# Altium schematic sheet ESenseFE-DigitalControl.SchDoc
size B
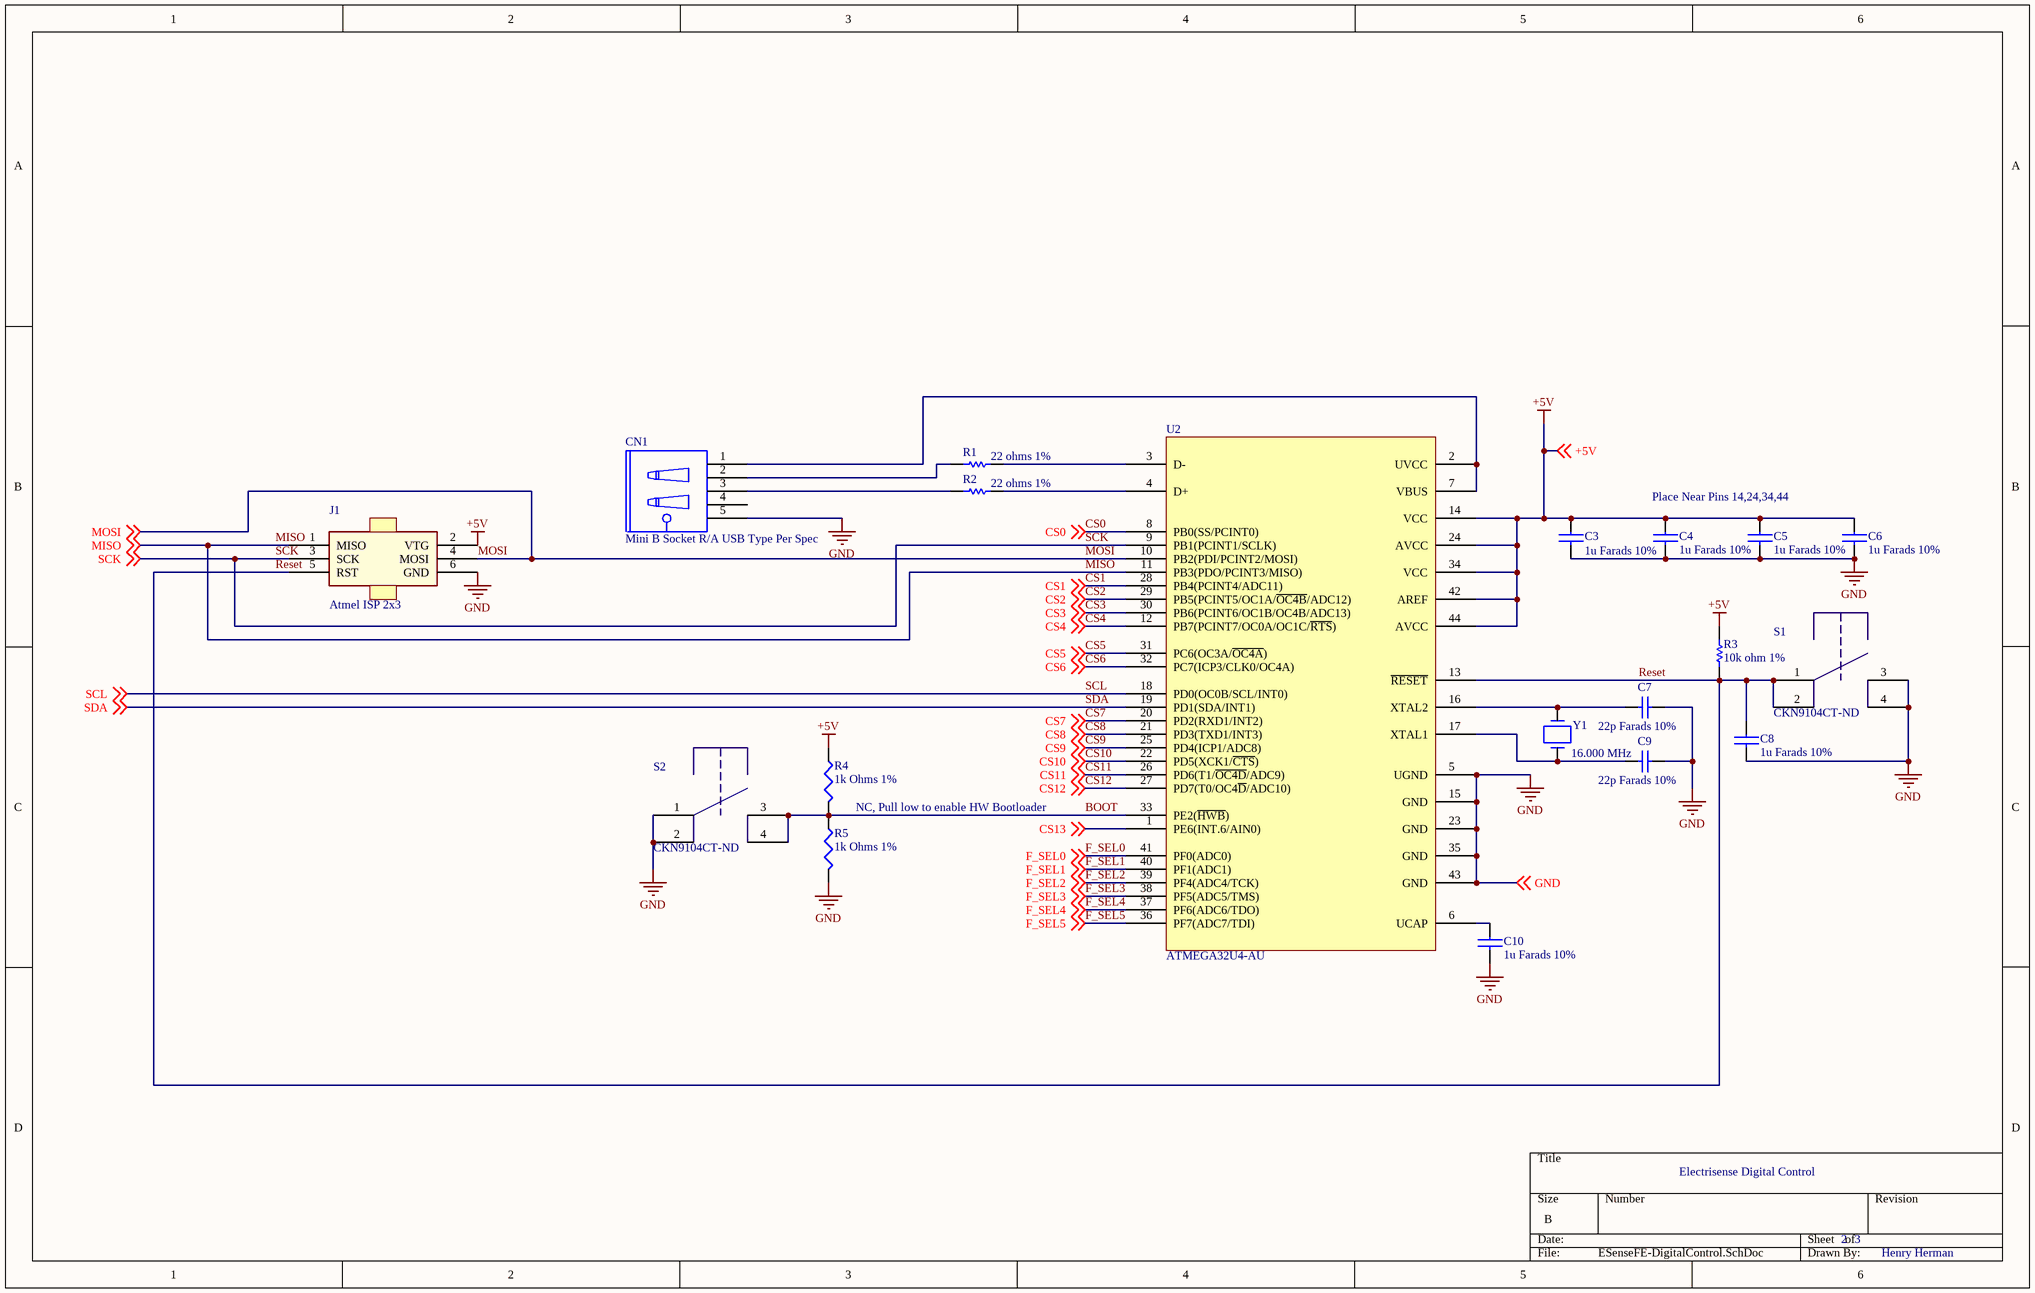
[diagram p0: ESenseFE-DigitalControl.SchDoc]

## Parts
C3  1u Farads 10%  [SM/C_0603]
C4  1u Farads 10%  [SM/C_0603]
C5  1u Farads 10%  [SM/C_0603]
C6  1u Farads 10%  [SM/C_0603]
C7  22p Farads 10%  [SM/C_0603]
C8  1u Farads 10%  [SM/C_0603]
C9  22p Farads 10%  [SM/C_0603]
C10  1u Farads 10%  [SM/C_0603]
CN1  Mini B Socket R/A USB Type Per Spec  [MOLEX/54819-0579]
J1  Atmel ISP 2x3  [FCI/75867/6]
R1  22 ohms 1%  [SM/C_0603]
R2  22 ohms 1%  [SM/C_0603]
R3  10k ohm 1%  [SM/C_0603]
R4  1k Ohms 1%  [SM/C_0603]
R5  1k Ohms 1%  [SM/C_0603]
S1  CKN9104CT-ND  [MOM-SW]
S2  CKN9104CT-ND  [MOM-SW]
U2  ATMEGA32U4-AU  [TQFP80P1200X1200X120-44L]
Y1  16.000 MHz  [ECS/CSM-7/2]

## Nets
+5V: C3.1 C4.1 C5.1 C6.1 J1.2(VTG) R3.2 R4.1 U2.14(VCC) U2.24(AVCC) U2.34(VCC) U2.42(AREF) U2.44(AVCC) ; off-sheet +5V
GND: C3.2 C4.2 C5.2 C6.2 C7.2 C8.2 C9.2 C10.2 CN1.5 J1.6(GND) R5.2 S1.3 S1.4 S2.1 S2.2 U2.5(UGND) U2.15(GND) U2.23(GND) U2.35(GND) U2.43(GND) ; off-sheet GND
BOOT: R4.2 R5.1 S2.3 S2.4 U2.33(PE2(~{HWB}))
CS0: U2.8(PB0(SS/PCINT0)) ; off-sheet CS0
CS1: U2.28(PB4(PCINT4/ADC11)) ; off-sheet CS1
CS2: U2.29(PB5(PCINT5/OC1A/~{OC4B}/ADC12)) ; off-sheet CS2
CS3: U2.30(PB6(PCINT6/OC1B/OC4B/ADC13)) ; off-sheet CS3
CS4: U2.12(PB7(PCINT7/OC0A/OC1C/~{RTS})) ; off-sheet CS4
CS5: U2.31(PC6(OC3A/~{OC4A})) ; off-sheet CS5
CS6: U2.32(PC7(ICP3/CLK0/OC4A)) ; off-sheet CS6
CS7: U2.20(PD2(RXD1/INT2)) ; off-sheet CS7
CS8: U2.21(PD3(TXD1/INT3)) ; off-sheet CS8
CS9: U2.25(PD4(ICP1/ADC8)) ; off-sheet CS9
CS10: U2.22(PD5(XCK1/~{CTS})) ; off-sheet CS10
CS11: U2.26(PD6(T1/~{OC4D}/ADC9)) ; off-sheet CS11
CS12: U2.27(PD7(T0/OC4~{D}/ADC10)) ; off-sheet CS12
CS13: U2.1(PE6(INT.6/AIN0)) ; off-sheet CS13
F_SEL0: U2.41(PF0(ADC0)) ; off-sheet F_SEL0
F_SEL1: U2.40(PF1(ADC1)) ; off-sheet F_SEL1
F_SEL2: U2.39(PF4(ADC4/TCK)) ; off-sheet F_SEL2
F_SEL3: U2.38(PF5(ADC5/TMS)) ; off-sheet F_SEL3
F_SEL4: U2.37(PF6(ADC6/TDO)) ; off-sheet F_SEL4
F_SEL5: U2.36(PF7(ADC7/TDI)) ; off-sheet F_SEL5
MISO: J1.1(MISO) U2.11(PB3(PDO/PCINT3/MISO)) ; off-sheet MISO
MOSI: J1.4(MOSI) U2.10(PB2(PDI/PCINT2/MOSI)) ; off-sheet MOSI
Reset: C8.1 J1.5(RST) R3.1 S1.1 S1.2 U2.13(~{RESET})
SCK: J1.3(SCK) U2.9(PB1(PCINT1/SCLK)) ; off-sheet SCK
SCL: U2.18(PD0(OC0B/SCL/INT0)) ; off-sheet SCL
SDA: U2.19(PD1(SDA/INT1)) ; off-sheet SDA
NetC7_1: C7.1 U2.16(XTAL2) Y1.2
NetC9_1: C9.1 U2.17(XTAL1) Y1.1
NetC10_1: C10.1 U2.6(UCAP)
NetCN1_1: CN1.1 U2.2(UVCC) U2.7(VBUS)
NetCN1_2: CN1.2 R1.1
NetCN1_3: CN1.3 R2.1
NetR1_2: R1.2 U2.3(D-)
NetR2_2: R2.2 U2.4(D+)

Not connected (* = marked no-connect by the designer): CN1 4

## Notes on the sheet
- Place Near Pins 14,24,34,44
- NC, Pull low to enable HW Bootloader
- Electrisense Digital Control
- 2
- 3
- Henry Herman

## Library data of the parts
C3-C6 C8 C10 = 2065: CAP CER 1.0UF 10V 10% X5R 0603; mfrName: Murata Electronics North America; mfrPartNum: GRM188R61A105KA61D; Extra_Description: Datasheets	Chip Monolithic Ceramic Caps Part Numbering / GRM Series Spec/Test Methods (1) / GRM188R61A105KA61 / Product Photos	0603 Murata MLCC Caps / Product Training Modules	High-Cap Multilayer Ceramic Capacitors / Catalog Drawings	GRM Series Top, Sides / Standard Package	10 / Category	Capacitors / Family	Ceramic / Series	GRM / Capacitance	1.0µF / Voltage - Rated	10V / Tolerance	±10% / Temperature Coefficient	X5R / Mounting Type	Surface Mount, MLCC / Operating Temperature	-55°C ~ 85°C / Features	- / Applications	General Purpose / Ratings	- / Package / Case	0603 (1608 Metric) / Size / Dimension	0.063`` L x 0.032`` W (1.60mm x 0.80mm) / Lead Spacing	- / Thickness	0.80mm / Packaging	Cut Tape (CT) / Lead Style	- / Catalog Page	1886 (US2010 Interactive) / 1886 (US2010 PDF) / Other Names	490-1543-1; Obsolete: False; Temp_Max: 0; Type: Ceramic; PartID: 2065; URL_Image: HTTP://MEDIA.DIGIKEY.COM/PHOTOS/MURATA%20PHOTOS/0603%20MURATA%20MLCC%20CAPS.JPG; URL_Datasheet: http://search.murata.co.jp/Ceramy/image/img/w_hinm/L0005E.pdf; Date_Created: 9/27/2010 4:47:48 PM; Date_LastModified: 9/27/2010 4:47:48 PM; Verified: False; RoHS: True; Temp_Min: 0
C7 C9 = 2187: ceramic multilayer capacitor; capacitor type:general; mfrName: AVX; mfrPartNum: 06031A220KAT2A; Label: 1uF; Extra_Description: Ceramic Multilayer Capacitor; Capacitor Type:General Purpose; Capacitance:22pF; Capacitance Tolerance:± 10%; Voltage Rating:100VDC; Capacitor Dielectric Type:Multilayer Ceramic; Package/Case:0603; Termination Type:SMD ;RoHS Compliant: Yes / Mounting Type: ``Surface Mount`` / Lead-Free Status: ``Lead Free`` / Packaging: ``Cut Tape (CT)`` / RoHS: ``Compliant`` / Size-Width: { / ``uncertainty_minus``: null, / ``value``: 0.00081, / ``uncertainty_plus``: null / } / Size-Length: { / ``uncertainty_minus``: null, / ``value``: 0.0016, / ``uncertainty_plus``: null / } / Size-Height: { / ``uncertainty_minus``: null, / ``value``: 0.00086, / ``uncertainty_plus``: null / } / Voltage Rating (DC): { / ``uncertainty_minus``: null, / ``value``: 100.0, / ``uncertainty_plus``: null / } / Capacitance: { / ``uncertainty_minus``: null, / ``value``: 2.2E-11, / ``uncertainty_plus``: null / } / Capacitance Tolerance: { / ``max_value``: 10.0, / ``max_uncertainty_plus``: null, / ``min_value``: -10.0, / ``min_uncertainty_plus``: null, / ``max_uncertainty_minus``: null / } / Operating Temperature: { / ``max_value``: 125.0, / ``max_uncertainty_plus``: null, / ``min_value``: null, / ``min_uncertainty_plus``: null, / ``max_uncertainty_minus``: null / } / Number of Pins: 2; Obsolete: False; Temp_Max: 0; Type: All Parts; TypeNotes: Applies to all parts in the database; PartID: 2187; URL_Image: http://cdn.sigma.octopart.com/8893021/image/AVX-06031A220KAT2A.jpg; URL_Datasheet: http://datasheet.octopart.com/06031A220KAT2A-AVX-datasheet-118583.pdf; Date_Created: 5/5/2011 6:57:51 AM; Date_LastModified: 5/5/2011 6:57:51 AM; Verified: False; RoHS: True; Temp_Min: 0
CN1 = 289: CONN RECEPT USB MINI-B R/A 5POS SMD; mfrName: Molex/Waldom Electronics Corp; mfrPartNum: 54819-0572; Extra_Description: Molex/Waldom Electronics Corp; Lead Free StatusLead Free; RoHS StatusRoHS Compliant; Other Names WM17116CT; Obsolete: False; Temp_Max: 70; Temp_Min: -20; PartID: 289; URL_Image: http://media.digikey.com/photos/Molex/54819-0572.jpg; URL_Datasheet: http://www.mouser.com/index.cfm?handler=displayproduct&lstdispproductid=802959&e_categoryid=620&e_pcodeid=53821; Date_Created: 3/1/2006 10:26:19 PM; Date_LastModified: 8/21/2009 1:12:36 AM; Verified: False; RoHS: True; Type: USB
J1 = 1838: CONN HEADER 6POS DUAL R/A PCB; mfrName: FCI; mfrPartNum: 75867-131LF; Symbol_Desc: ISP Pinout; Symbol_Desc2: PDI Pinout; Extra_Description: Datasheets	75867 / Product Photos	75867-131LF / Standard Package	100 / Category	Connectors, Interconnects / Family	Rectangular - Headers, Male Pins / Series	Quickie™, Basics+ / Contact Type	Male Pin / Connector Type	Header, Shrouded / Number of Positions	6 / Number of Positions Loaded	All / Pitch	0.100`` (2.54mm) / Number of Rows	2 / Row Spacing	0.100`` (2.54mm) / Contact Mating Length	0.236`` (6.00mm) / Mounting Type	Through Hole, Right Angle / Termination	Solder / Fastening Type	- / Features	- / Contact Finish	Gold, GXT™ / Contact Finish Thickness	30µin (0.76µm) / Color	Blue / Packaging	Tube / Catalog Page	59 (US2010 Interactive) / 59 (US2010 PDF) / Mating Products	609-3567-ND - CONN SOCKET IDC 6POS DL SR 30AU / 71600-206LF-ND - CONN SOCKET IDC 6POS DL SR 30AU / 609-3067-ND - CONN SOCKET IDC 6POS DL 30GOLD / 71600-406LF-ND - QUICKIE / 609-2842-ND - CONN SOCKET IDC 6POS DUAL 30GOLD / 609-2841-ND - CONN SOCKET IDC 6POS DL SR 30AU / Other Names	609-2846; Obsolete: False; Temp_Max: 0; PartID: 1838; mfrWebsite: http://portal.fciconnect.com; URL_Image: http://media.digikey.com/photos/FCI%20Photos/75867-131LF_FCI.JPG; URL_Datasheet: http://portal.fciconnect.com/res/en/pdffiles/doc_search/75867.pdf; Date_Created: 1/16/2010 6:25:16 PM; Date_LastModified: 1/16/2010 6:25:16 PM; Verified: False; RoHS: True; Temp_Min: 0; Type: UNKNOWN
R1 R2 = 2185: rating:75v; temperature coefficient; mfrName: Panasonic; mfrPartNum: ERJ3EKF22R0V; Value: 1K; Extra_Description: RESISTOR, 0603, 0.1W, 1%, 22R; Resistance:22ohm; Resistance Tolerance:± 1%; Power Rating:0.1W; Voltage Rating:75V; Series:ERJ; Temperature Coefficient:± 200ppm/°C; Resistor Element Type:Thick Film; Resistor Case Style:0603; No. of Pins:2; Case Style:0603; External Length / Height:0.45mm; External Depth:0.8mm; External Width:1.6mm; Operating Temperature Range:-55°C to +155°C; Overload Voltage:150V; Reel Quantity:5000; Termination Type:SMD; Obsolete: False; Temp_Max: 0; TypeNotes: Applies to all parts in the database; Published: 8-Jun-2000; LatestRevisionDate: 17-Jul-2002; LatestRevisionNote: Re-released for DXP Platform.; PackageReference: AXIAL-0.3; Publisher: Altium Limited; PartID: 2185; URL_Image: http://cdn.sigma.octopart.com/8893006/image/Panasonic-ERJ3EKF22R0V.jpg; URL_Datasheet: http://datasheet.octopart.com/ERJ3EKF22R0V-Panasonic-datasheet-5313456.pdf; Date_Created: 5/5/2011 6:06:39 AM; Date_LastModified: 5/5/2011 6:06:39 AM; Verified: False; RoHS: True; Temp_Min: 0; Type: All Parts
R3 = 2165: resistor, 0603, 0.1w, 1%, 10k; resistance:10kohm; resistance; mfrName: Panasonic; mfrPartNum: ERJ-3EKF1002V; Value: 1K; Extra_Description: RESISTOR, 0603, 0.1W, 1%, 10K; Resistance:10kohm; Resistance Tolerance:± 1%; Power Rating:0.1W; Voltage Rating:75V; Series:ERJ; Temperature Coefficient:± 200ppm/°C; Resistor Element Type:Thick Film; Resistor Case Style:0603; No. of Pins:2; Case Style:0603; External Length / Height:0.45mm; External Depth:0.8mm; External Width:1.6mm; Operating Temperature Range:-55°C to +155°C; Overload Voltage:150V; Reel Quantity:5000; Termination Type:SMD / Mounting Type: ``Surface Mount`` / Case / Package: ``0603`` / Packaging: ``Cut Tape (CT)`` / Lead-Free Status: ``Contains Lead`` / RoHS: ``Compliant`` / Resistance: { / ``uncertainty_minus``: null, / ``value``: 10000.0, / ``uncertainty_plus``: null / } / Voltage Rating (DC): { / ``uncertainty_minus``: null, / ``value``: 75.0, / ``uncertainty_plus``: null / } / Size-Width: { / ``uncertainty_minus``: null, / ``value``: 0.0008, / ``uncertainty_plus``: null / } / Size-Length: { / ``uncertainty_minus``: null, / ``value``: 0.0016, / ``uncertainty_plus``: null / } / Size-Height: { / ``uncertainty_minus``: null, / ``value``: 0.00045, / ``uncertainty_plus``: null / } / Power Rating: { / ``uncertainty_minus``: null, / ``value``: 0.1, / ``uncertainty_plus``: null / } / Resistance Tolerance: { / ``max_value``: 1.0, / ``max_uncertainty_plus``: null, / ``min_value``: -1.0, / ``min_uncertainty_plus``: null, / ``max_uncertainty_minus``: null / } / Operating Temperature: { / ``max_value``: 125.0, / ``max_uncertainty_plus``: null, / ``min_value``: null, / ``min_uncertainty_plus``: null, / ``max_uncertainty_minus``: null / } / Number of Pins: 2; Obsolete: False; Temp_Max: 0; TypeNotes: Applies to all parts in the database; Published: 8-Jun-2000; LatestRevisionDate: 17-Jul-2002; LatestRevisionNote: Re-released for DXP Platform.; PackageReference: AXIAL-0.3; Publisher: Altium Limited; PartID: 2165; URL_Image: http://cdn.sigma.octopart.com/8893006/image/Panasonic-ERJ-3EKF1002V.jpg; URL_Datasheet: http://datasheet.octopart.com/ERJ-3EKF1002V-Panasonic-datasheet-118621.pdf; Date_Created: 4/24/2011 7:23:38 AM; Date_LastModified: 4/24/2011 7:23:38 AM; Verified: False; RoHS: True; Temp_Min: 0; Type: All Parts
R4 R5 = 2043: RES 1.00K OHM 1/10W 1% 0603 SMD; mfrName: Panasonic - ECG; mfrPartNum: ERJ-3EKF1001V; Extra_Description: Datasheets	ERJ-3EKF1001V View All Specifications / Product Photos	0603 Pkg / Catalog Drawings	1% Thick Film Chip Material / 1% Thick Film Chip / Standard Package	200 / Category	Resistors / Family	Chip Resistor - Surface Mount / Series	ERJ / Resistance In Ohms	1.00K / Power (Watts)	0.1W, 1/10W / Composition	Thick Film / Features	- / Temperature Coefficient	±100ppm/°C / Tolerance	±1% / Case	0603 (1608 metric) / Size / Dimension	0.063`` L x 0.031`` W (1.60mm x 0.80mm) / Height	0.018`` (0.45mm) / Lead Style	Surface Mount (SMD - SMT) / Packaging	Cut Tape (CT) / Catalog Page	1954 (US2010 Interactive) / 1954 (US2010 PDF) / Kits	RSM3H-ND - KIT CHIP RES 96 VALUES 50EA 0603 / Other Names	ERJ-3EKF1001 / ERJ3EKF1001 / P1.00KHCT; Obsolete: False; Temp_Max: 0; PartID: 2043; URL_Image: http://media.digikey.com/photos/Panasonic%20Photos/10-0603%20Resistor.jpg?cshift_ck=null&client_id=5042; URL_Datasheet: http://industrial.panasonic.com/www-cgi/jvcr13pz.cgi?E+PZ+3+AOA0002+ERJ3EKF1001V+7+WW; Date_Created: 9/14/2010 11:34:31 AM; Date_LastModified: 9/14/2010 11:34:31 AM; Verified: False; RoHS: True; Temp_Min: 0; Type: Chip Resistor - Surface Mount
S1 S2 = 2128: SW - SPST-NO - SM; mfrName: C&K Components; Extra_Description: PTS 525 Series / Microminiature Tact Switch for SMT; Obsolete: False; Temp_Max: 0; PartID: 2128; mfrPartNum: CKN9104CT-ND; mfrWebsite: http://digikey.com/Suppliers/us/C-and-K-Components.page?lang=EN; URL_Image: http://media.digikey.com/photos/CK%20Comp%20Photos/PTS525SM10SMTR.jpg; URL_Datasheet: http://www.ck-components.com/index.php?module=media&action=Display&cmpref=14407&lang=en&width=&height=&format=&alt=; Date_Created: 2/24/2011 10:42:02 PM; Date_LastModified: 2/24/2011 10:42:02 PM; Verified: False; RoHS: True; Temp_Min: 0; Type: Pushbutton (Push Button)
U2 = 2175: mcu, 8bit, avr, 32k flash, usb, 44tqfp; eeprom memory; mfrName: Atmel; Extra_Description: MCU, 8BIT, AVR, 32K FLASH, USB, 44TQFP; EEPROM Memory Size:1KB; RAM Memory Size:2.5KB; No. of Timers:5; No. of PWM Channels:14; Operating Temperature Range:-40°C to +85°C; No. of Pins:44; Case Style:TQFP; Clock Frequency:16MHz; Flash Memory Size:32KB; Interface Type:I2C, JTAG, SPI, USART, USB; Logic Function Number:32; Max Supply Voltage:5.5V; Min Supply Voltage:2.7V; No. of ADC Inputs:12; No. of I/O Lines:26; Series:ATMEGA; Termination Type:SMD / RoHS: ``Compliant`` / Clock Speed: { / ``uncertainty_minus``: null, / ``value``: 16000000.0, / ``uncertainty_plus``: null / } / Number of Pins: 44; Obsolete: False; Temp_Max: 0; TypeNotes: Applies to all parts in the database; PartID: 2175; mfrPartNum: ATMEGA32U4-AU; URL_Image: http://cdn.sigma.octopart.com/8899375/image/Atmel-ATMEGA32U4-AU.jpg; URL_Datasheet: http://datasheet.octopart.com/ATMEGA32U4-AU-Atmel-datasheet-8370675.pdf; Date_Created: 5/4/2011 9:48:10 PM; Date_LastModified: 5/4/2011 9:48:10 PM; Verified: False; RoHS: True; Temp_Min: 0; Type: All Parts
Y1 = 1075: CRYSTAL 16.00MHZ 20PF SMD; mfrName: ECS Inc; mfrPartNum: ECS-160-20-5P-TR; Extra_Description: ECS Inc / Frequency16.000MHz / Load Capacitance20pF / Package / CaseSurface Mount (smd-smt) / PackagingCut Tape (CT) / Other NamesECS-160-20-5P / XC694CT; PartID: 1075; URL_Datasheet: http://www.digikey.com/scripts/DkSearch/dksus.dll?Pname?Name=xc694ct-nd&Site=US; Date_Created: 6/11/2005 10:42:52 PM; Date_LastModified: 8/21/2009 1:12:54 AM; Verified: False; Type: Crystals